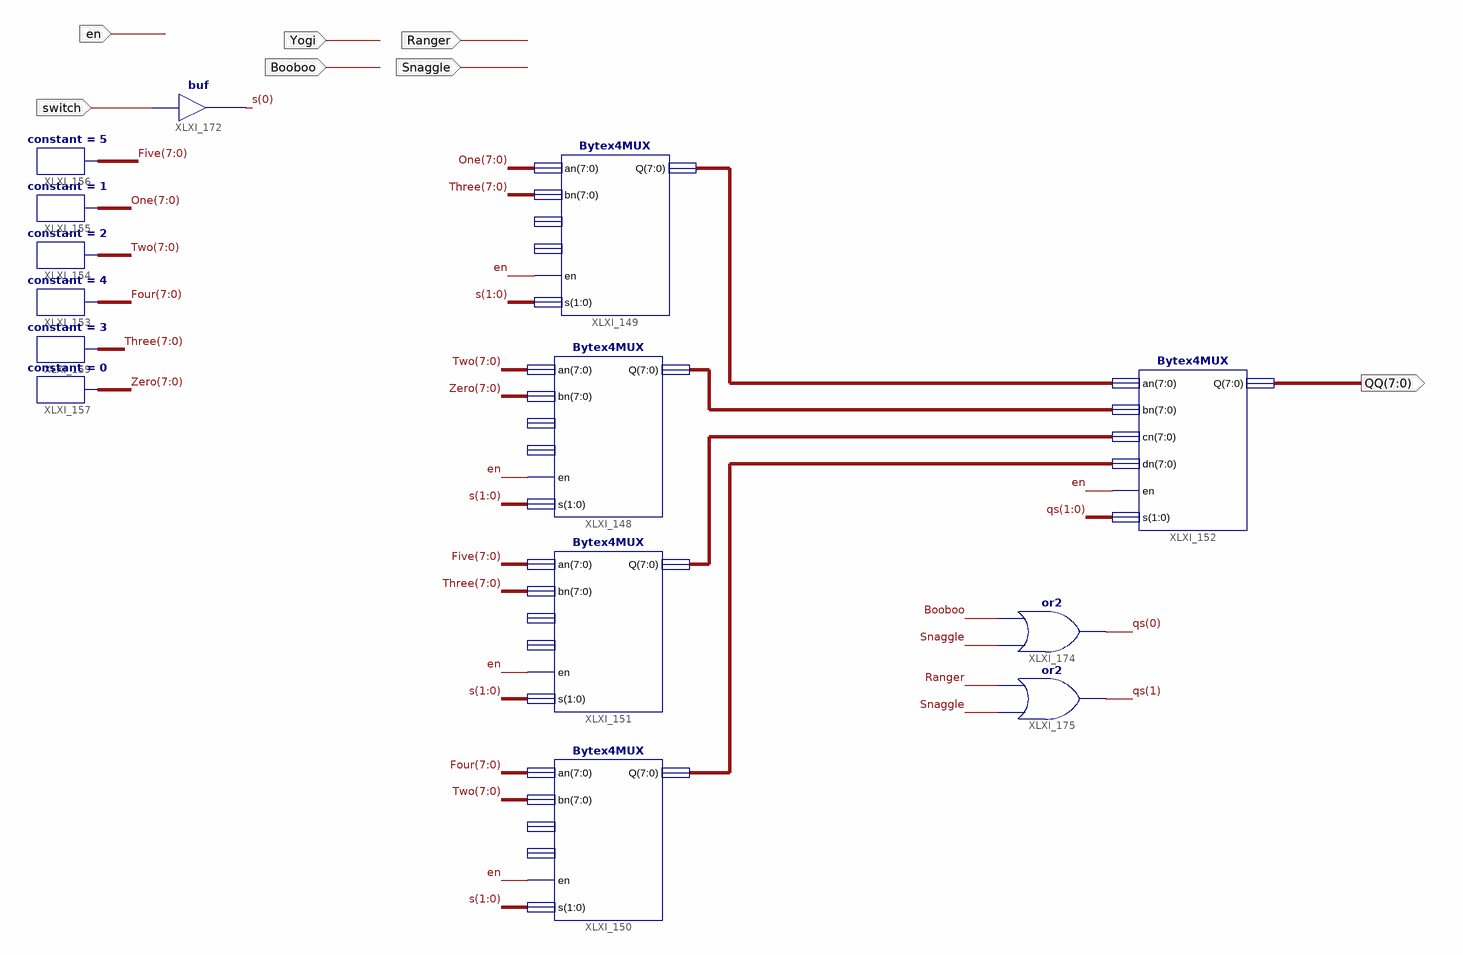
[diagram p0: schematic sheet 1]
// Xilinx ISE schematic muxC.sch (spartan3e) as structural Verilog: 14 symbols, 7 ports
module muxC (
  input  en,
  input  Ranger,
  input  Snaggle,
  input  Yogi,
  input  Booboo,
  input  switch,
  output [7:0] QQ
);

  wire [1:0] qs, s;
  wire [7:0] Five, Four, One, Three, Two, XLXN_17, XLXN_18, XLXN_19, XLXN_20, Zero;

  Bytex4MUX XLXI_148 (.bn(Zero), .an(Two), .en(en), .s(s), .Q(XLXN_18));  // open: cn, dn
  Bytex4MUX XLXI_149 (.bn(Three), .an(One), .en(en), .s(s), .Q(XLXN_17));  // open: cn, dn
  Bytex4MUX XLXI_150 (.bn(Two), .an(Four), .en(en), .s(s), .Q(XLXN_20));  // open: cn, dn
  Bytex4MUX XLXI_151 (.bn(Three), .an(Five), .en(en), .s(s), .Q(XLXN_19));  // open: cn, dn
  Bytex4MUX XLXI_152 (.bn(XLXN_18), .an(XLXN_17), .cn(XLXN_19), .dn(XLXN_20), .en(en), .s(qs), .Q(QQ));
  constant #(.CValue("4")) XLXI_153 (.O(Four));
  constant #(.CValue("2")) XLXI_154 (.O(Two));
  constant #(.CValue("1")) XLXI_155 (.O(One));
  constant #(.CValue("3")) XLXI_159 (.O(Three));
  constant #(.CValue("0")) XLXI_157 (.O(Zero));
  constant #(.CValue("5")) XLXI_156 (.O(Five));
  buf XLXI_172 (s[0], switch);
  or XLXI_174 (qs[0], Snaggle, Booboo);
  or XLXI_175 (qs[1], Snaggle, Ranger);
endmodule
